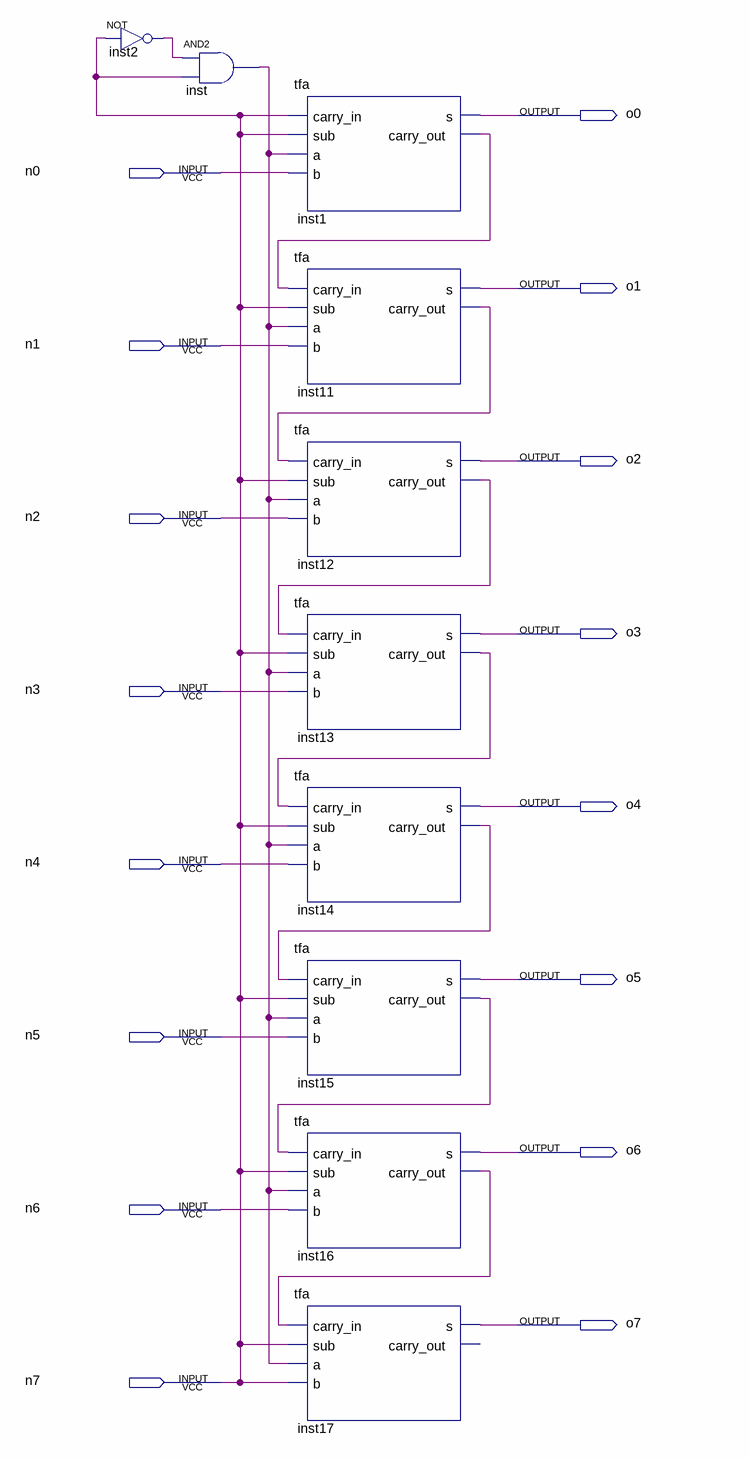
[diagram p0: schematic sheet]
// Quartus schematic jdz.bdf as structural Verilog: 10 symbols, 16 pins
module jdz (
  input  n0,
  input  n1,
  input  n2,
  input  n3,
  input  n4,
  input  n5,
  input  n6,
  input  n7,
  output o0,
  output o1,
  output o2,
  output o3,
  output o4,
  output o5,
  output o6,
  output o7
);

  wire inst1_carry_out, inst2_out, inst11_carry_out, inst12_carry_out, inst13_carry_out, inst14_carry_out,
       inst15_carry_out, inst16_carry_out, inst_out;

  not inst2 (inst2_out, n7);
  and inst (inst_out, inst2_out, n7);
  tfa inst1 (.carry_in(n7), .sub(n7), .a(inst_out), .b(n0), .s(o0), .carry_out(inst1_carry_out));
  tfa inst11 (.carry_in(inst1_carry_out), .sub(n7), .a(inst_out), .b(n1), .s(o1), .carry_out(inst11_carry_out));
  tfa inst12 (.carry_in(inst11_carry_out), .sub(n7), .a(inst_out), .b(n2), .s(o2), .carry_out(inst12_carry_out));
  tfa inst13 (.carry_in(inst12_carry_out), .sub(n7), .a(inst_out), .b(n3), .s(o3), .carry_out(inst13_carry_out));
  tfa inst14 (.carry_in(inst13_carry_out), .sub(n7), .a(inst_out), .b(n4), .s(o4), .carry_out(inst14_carry_out));
  tfa inst15 (.carry_in(inst14_carry_out), .sub(n7), .a(inst_out), .b(n5), .s(o5), .carry_out(inst15_carry_out));
  tfa inst16 (.carry_in(inst15_carry_out), .sub(n7), .a(inst_out), .b(n6), .s(o6), .carry_out(inst16_carry_out));
  tfa inst17 (.carry_in(inst16_carry_out), .sub(n7), .a(inst_out), .b(n7), .s(o7));  // open: carry_out
endmodule
